# Altium project M.2 Accelerator.PrjPcb (part 2 of 2)
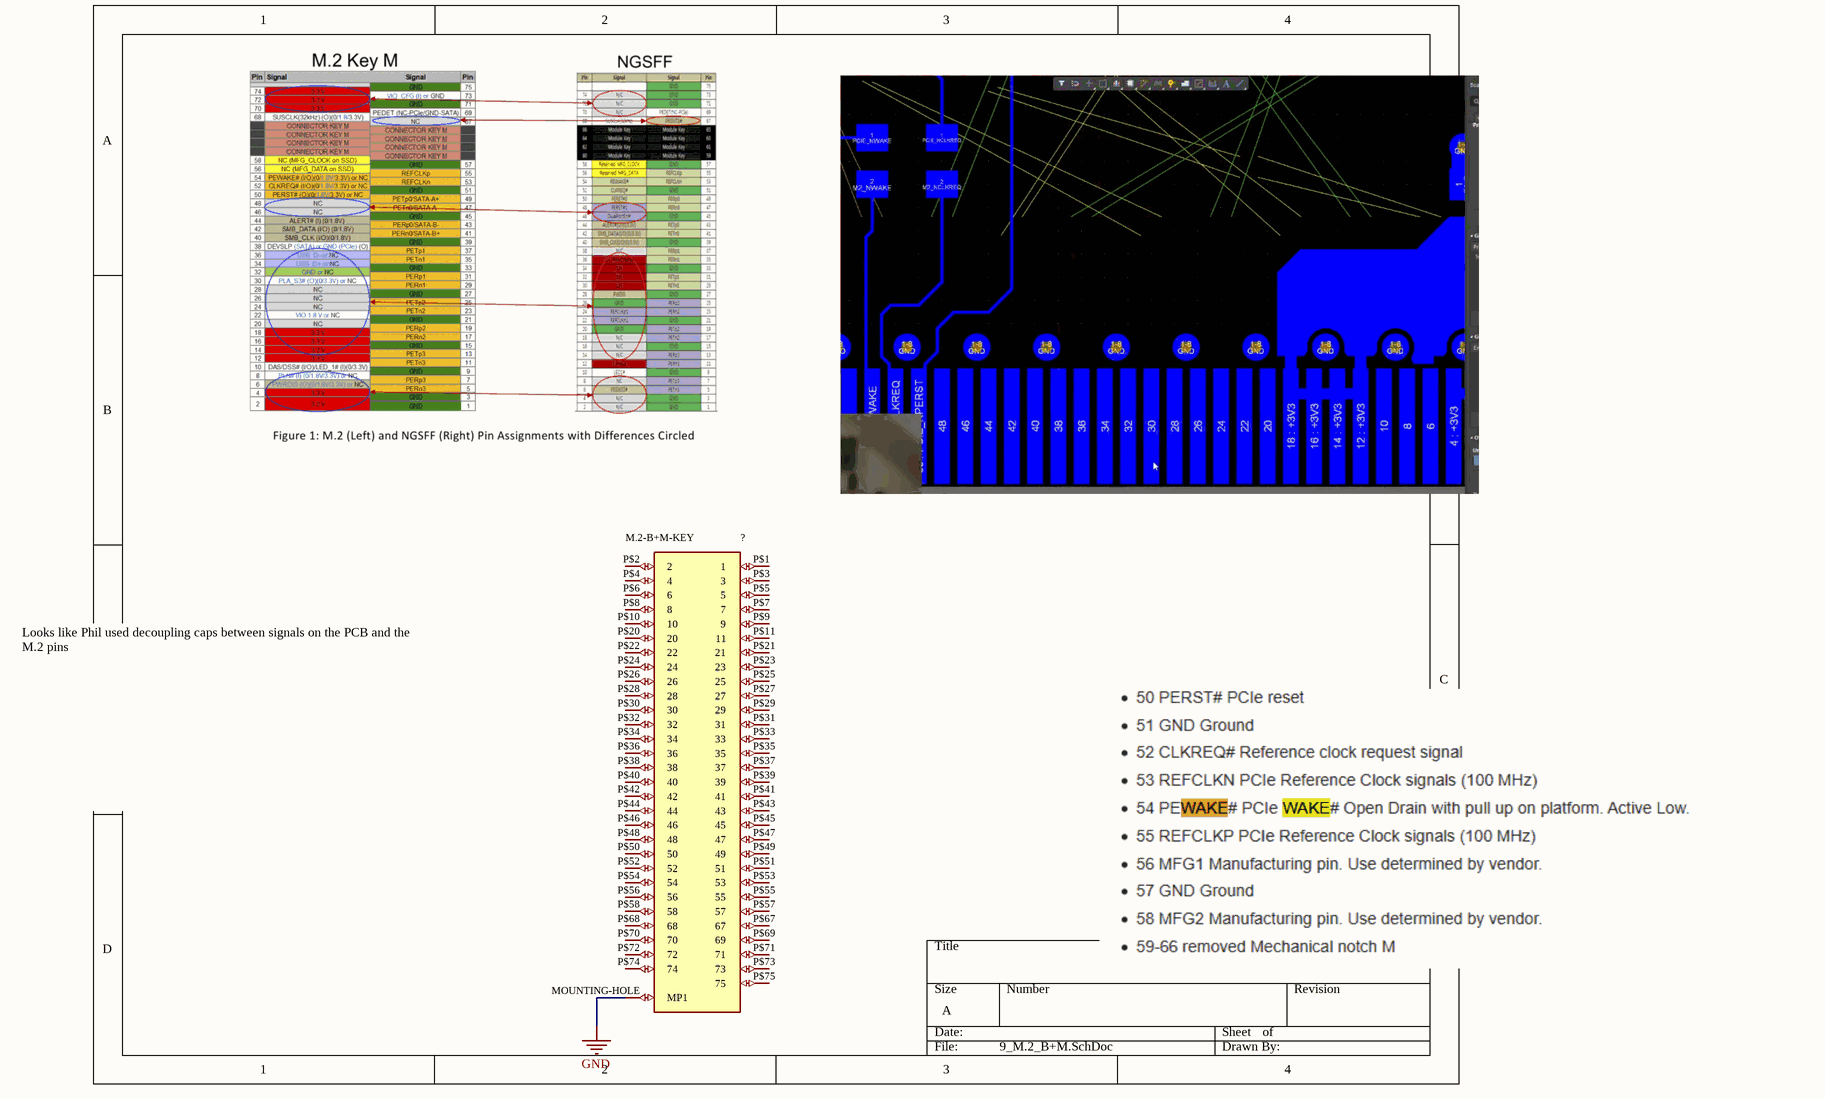
[diagram p8: 9_M.2_B+M.SchDoc]

## Nets that join several sheets
+1V8: 2_PowerRails (C207.1 C208.1 L203.2 R205.1), 3_PowerDistribution (16 pins)
+1V35: 2_PowerRails (C210.1 C211.1 L204.2 R208.1), 3_PowerDistribution (13 pins)
BUCK AGND: 2_PowerRails (12 pins), 3_PowerDistribution (172 pins), 4_Configuration (10 pins), 5_GPIOBanks (C?#89.2 R?#20.1 Y?#2.2), 9_M.2_B+M (?.MOUNTING-HOLE)
BUCK EN1: 2_PowerRails (5 pins), 3_PowerDistribution (67 pins), 4_Configuration (12 pins), 5_GPIOBanks (7 pins)
BUCK FB1: 2_PowerRails (C201.1 L201.2 U201.28), 3_PowerDistribution (43 pins)
QSPI_CS_N: 4_Configuration (R?#13.2 U?#12.7), 5_GPIOBanks (U?#13.T19)
QSPI_DQ0: 4_Configuration (U?#12.15), 5_GPIOBanks (U?#13.P22)
QSPI_DQ1: 4_Configuration (U?#12.8), 5_GPIOBanks (U?#13.R22)
QSPI_DQ2: 4_Configuration (R?#11.2 U?#12.9), 5_GPIOBanks (U?#13.P21)
QSPI_DQ3: 4_Configuration (R?#12.2 U?#12.1), 5_GPIOBanks (U?#13.R21)
QSPI_RST_N: 4_Configuration (U?#12.3), 5_GPIOBanks (U?#13.R19)
XADCGND: 3_PowerDistribution (C?#31.2 FB?#2.1 U?#1.K9), 4_Configuration (6 pins)